# Altium schematic sheet SignalAnalyse.SchDoc
size A4
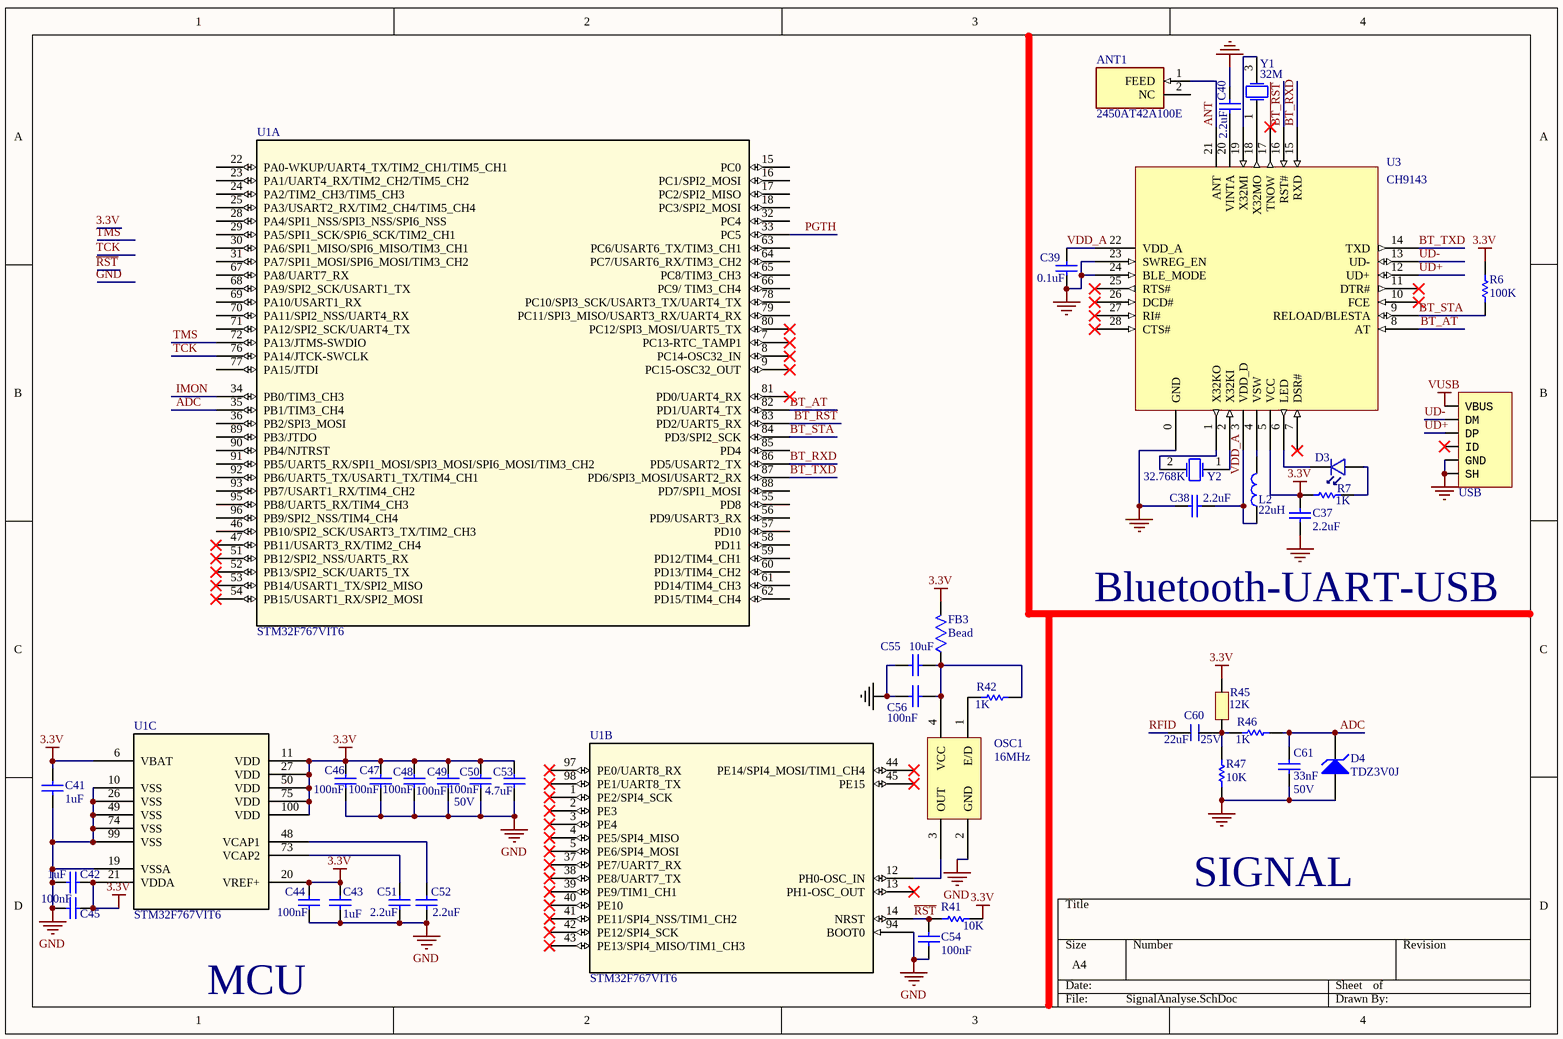
[diagram p0: SignalAnalyse.SchDoc]

## Parts
ANT1  2450AT42A100E  [ANTC5020X110N]
C37  value 2.2uF  [1608[0603]]  (hidden comment: GRM188R61A226ME15D)
C38  value 2.2uF  [1608[0603]]  (hidden comment: GRM188R61A226ME15D)
C39  value 0.1uF  [1608[0603]]  (hidden comment: GRM188R61A226ME15D)
C40  value 2.2uF  [1608[0603]]  (hidden comment: GRM188R61A226ME15D)
C41  value 1uF  [1608[0603]]  (hidden comment: GRM188R61A226ME15D)
C42  value 1uF  [1608[0603]]  (hidden comment: GRM188R61A226ME15D)
C43  value 1uF  [1608[0603]]  (hidden comment: GRM188R61A226ME15D)
C44  value 100nF  [1608[0603]]  (hidden comment: GRM188R61A226ME15D)
C45  value 100nF  [1608[0603]]  (hidden comment: GRM188R61A226ME15D)
C46  value 100nF  [1608[0603]]  (hidden comment: GRM188R61A226ME15D)
C47  value 100nF  [1608[0603]]  (hidden comment: GRM188R61A226ME15D)
C48  value 100nF  [1608[0603]]  (hidden comment: GRM188R61A226ME15D)
C49  value 100nF  [1608[0603]]  (hidden comment: GRM188R61A226ME15D)
C50  value 100nF  Voltage: 50V  [1608[0603]]  (hidden comment: GRM188R61A226ME15D)
C51  value 2.2uF  [1608[0603]]  (hidden comment: GRM188R61A226ME15D)
C52  value 2.2uF  [1608[0603]]  (hidden comment: GRM188R61A226ME15D)
C53  value 4.7uF  [1608[0603]]  (hidden comment: GRM188R61A226ME15D)
C54  value 100nF  [1608[0603]]  (hidden comment: GRM188R61A226ME15D)
C55  value 10uF  [1608[0603]]  (hidden comment: GRM188R61A226ME15D)
C56  value 100nF  [1608[0603]]  (hidden comment: GRM188R61A226ME15D)
C60  value 22uF  Voltage: 25V  [C0805]  (hidden comment: Cap Ceramic)
C61  value 33nF  Voltage: 50V  [1608[0603]]  (hidden comment: Cap Semi)
D3  LED-Green  [D0805]  (value not drawn)
D4  TDZ3V0J  [SOD-323]
FB3  Bead  [BEADC2012X110N]
L2  22uH  [L0805]
OSC1  16MHz  [OSC_3.2X2.5]
R6  value 100K  [J1-0603]  (hidden comment: Res 2.2KΩ ±1%)
R7  value 1K  [J1-0603]  (hidden comment: Res 2.2KΩ ±1%)
R41  value 10K  [J1-0603]  (hidden comment: Res 2.2KΩ ±1%)
R42  value 1K  [J1-0603]  (hidden comment: Res 2.2KΩ ±1%)
R45  value 12K  [R0805]  (hidden comment: R)
R46  value 1K  [J1-0603]  (hidden comment: Res 2.2KΩ ±1%)
R47  value 10K  [J1-0603]  (hidden comment: Res 2.2KΩ ±1%)
U1  STM32F767VIT6  [STM32F767VIT6]  (parts A,B,C of 3)
U3  CH9143  [QFN28_4X4]
USB  MicroUSB  [USB_Micro-AB]  (value not drawn)
Y1  32M  [SMD2016-4N]
Y2  32.768K  [Q13FC1350000400]

## Nets
3.3V: C37.2 C41.1 C42.1 C43.2 C44.2 C45.1 C46.2 C47.2 C48.2 C49.2 C50.2 C53.2 FB3.2 R6.1 R7.1 R41.2 R45.2 U1.6(VBAT) U1.11(VDD) U1.20(VREF+) U1.21(VDDA) U1.27(VDD) U1.50(VDD) U1.75(VDD) U1.100(VDD) U3.5(VCC)
GND: C37.1 C38.1 C39.2 C40.1 C41.2 C42.2 C43.1 C44.1 C45.2 C46.1 C47.1 C48.1 C49.1 C50.1 C51.1 C52.1 C53.1 C54.2 C55.2 C56.2 C61.1 D4.1(A) OSC1.2(GND) R47.2 U1.10(VSS) U1.19(VSSA) U1.26(VSS) U1.49(VSS) U1.74(VSS) U1.94(BOOT0) U1.99(VSS) U3.0(GND) U3.23(SWREG_EN) U3.24(BLE_MODE) USB.0(SH) USB.5(GND)
VUSB: USB.1(VBUS)
ADC: C61.2 D4.2(K) R46.2 U1.35(PB1/TIM3_CH4)
ANT: ANT1.1(FEED) U3.21(ANT)
~{BT_RST}: U1.83(PD2/UART5_RX) U3.16(RST#)
BT_AT: U1.82(PD1/UART4_TX) U3.8(AT)
BT_RXD: U1.86(PD5/USART2_TX) U3.15(RXD)
BT_STA: R6.2 U1.84(PD3/SPI2_SCK) U3.9(RELOAD/BLESTA)
BT_TXD: U1.87(PD6/SPI3_MOSI/USART2_RX) U3.14(TXD)
IMON: U1.34(PB0/TIM3_CH3)
PGTH: U1.33(PC5)
~{RST}: C54.1 R41.1 U1.14(NRST)
RFID: C60.1
TCK: U1.76(PA14/JTCK-SWCLK)
TMS: U1.72(PA13/JTMS-SWDIO)
UD+: U3.12(UD+) USB.3(DP)
UD-: U3.13(UD-) USB.2(DM)
VDD_A: C38.2 C39.1 L2.1 U3.3(VDD_D) U3.22(VDD_A)
NetC40_2: C40.2 U3.20(VINTA)
NetC51_2: C51.2 U1.73(VCAP2)
NetC52_2: C52.2 U1.48(VCAP1)
NetC55_1: C55.1 C56.1 FB3.1 OSC1.4(VCC) R42.2
NetC60_2: C60.2 R45.1 R46.1 R47.1
NetD3_1: D3.1 R7.2
NetD3_2: D3.2 U3.6(LED)
NetL2_2: L2.2 U3.4(VSW)
NetOSC1_1: OSC1.1(E/D) R42.1
NetOSC1_3: OSC1.3(OUT) U1.12(PH0-OSC_IN)
NetU3_1: U3.1(X32KO) Y2.2(CRYSTAL_2)
NetU3_2: U3.2(X32KI) Y2.1(CRYSTAL_1)
NetU3_18: U3.18(X32MO) Y1.1(OSC1)
NetU3_19: U3.19(X32MI) Y1.3(OSC2)

Not connected (* = marked no-connect by the designer): ANT1 2(NC); U1 1(PE2/SPI4_SCK)* 2(PE3)* 3(PE4)* 4(PE5/SPI4_MISO)* 5(PE6/SPI4_MOSI)* 7(PC13-RTC_TAMP1)* 8(PC14-OSC32_IN)* 9(PC15-OSC32_OUT)* 13(PH1-OSC_OUT)* 15(PC0) 16(PC1/SPI2_MOSI) 17(PC2/SPI2_MISO) 18(PC3/SPI2_MOSI) 22(PA0-WKUP/UART4_TX/TIM2_CH1/TIM5_CH1) 23(PA1/UART4_RX/TIM2_CH2/TIM5_CH2) 24(PA2/TIM2_CH3/TIM5_CH3) 25(PA3/USART2_RX/TIM2_CH4/TIM5_CH4) 28(PA4/SPI1_NSS/SPI3_NSS/SPI6_NSS) 29(PA5/SPI1_SCK/SPI6_SCK/TIM2_CH1) 30(PA6/SPI1_MISO/SPI6_MISO/TIM3_CH1) 31(PA7/SPI1_MOSI/SPI6_MOSI/TIM3_CH2) 32(PC4) 36(PB2/SPI3_MOSI) 37(PE7/UART7_RX)* 38(PE8/UART7_TX)* 39(PE9/TIM1_CH1)* 40(PE10)* 41(PE11/SPI4_NSS/TIM1_CH2)* 42(PE12/SPI4_SCK)* 43(PE13/SPI4_MISO/TIM1_CH3)* 44(PE14/SPI4_MOSI/TIM1_CH4)* 45(PE15)* 46(PB10/SPI2_SCK/USART3_TX/TIM2_CH3) 47(PB11/USART3_RX/TIM2_CH4)* 51(PB12/SPI2_NSS/UART5_RX)* 52(PB13/SPI2_SCK/UART5_TX)* 53(PB14/USART1_TX/SPI2_MISO)* 54(PB15/USART1_RX/SPI2_MOSI)* 55(PD8) 56(PD9/USART3_RX) 57(PD10) 58(PD11) 59(PD12/TIM4_CH1) 60(PD13/TIM4_CH2) 61(PD14/TIM4_CH3) 62(PD15/TIM4_CH4) 63(PC6/USART6_TX/TIM3_CH1) 64(PC7/USART6_RX/TIM3_CH2) 65(PC8/TIM3_CH3) 66(PC9/_TIM3_CH4) 67(PA8/UART7_RX) 68(PA9/SPI2_SCK/USART1_TX) 69(PA10/USART1_RX) 70(PA11/SPI2_NSS/UART4_RX) 71(PA12/SPI2_SCK/UART4_TX) 77(PA15/JTDI) 78(PC10/SPI3_SCK/USART3_TX/UART4_TX) 79(PC11/SPI3_MISO/USART3_RX/UART4_RX) 80(PC12/SPI3_MOSI/UART5_TX)* 81(PD0/UART4_RX)* 85(PD4) 88(PD7/SPI1_MOSI) 89(PB3/JTDO) 90(PB4/NJTRST) 91(PB5/UART5_RX/SPI1_MOSI/SPI3_MOSI/SPI6_MOSI/TIM3_CH2) 92(PB6/UART5_TX/USART1_TX/TIM4_CH1) 93(PB7/USART1_RX/TIM4_CH2) 95(PB8/UART5_RX/TIM4_CH3) 96(PB9/SPI2_NSS/TIM4_CH4) 97(PE0/UART8_RX)* 98(PE1/UART8_TX)*; U3 7(DSR#)* 10(FCE)* 11(DTR#)* 17(TNOW)* 25(RTS#)* 26(DCD#)* 27(RI#)* 28(CTS#)*; USB 4(ID)*

## Notes on the sheet
- Bluetooth-UART-USB
- SIGNAL
- MCU
- Labels drawn without touching a wire or pin: 3.3V, GND, TCK, TMS, ~{RST}

## Library data of the parts
ANT1 = 2450AT42A100E: Antenna; Manufacturer_Name: JOHANSON TECHNOLOGY; Datasheet Link: https://mouser.componentsearchengine.com/Datasheets/2/2450AT42A100E.pdf; Height: 1.1mm; Manufacturer_Part_Number: 2450AT42A100E; Mouser Part Number: 609-2450AT42A100E; Mouser Price/Stock: https://www.mouser.co.uk/ProductDetail/Johanson-Technology/2450AT42A100E/?qs=yCnrNFeXz%252BhaJmvBFFPWJQ%3D%3D; Arrow Part Number: 2450AT42A100E; Arrow Price/Stock: https://www.arrow.com/en/products/2450at42a100e/johanson-dielectrics
C37-C40 C53 = Cap Semi: Capacitor (Semiconductor SIM Model); Voltage: 10V; Published: 8-Jun-2000; LatestRevisionDate: 29-May-2009; LatestRevisionNote: IPC-7351 Footprint Added.; PackageReference: C1206; Publisher: Altium Limited; PackageDescription: Chip Capacitor
C41-C49 C54 C56 = Cap Semi: Capacitor (Semiconductor SIM Model); Voltage: 50V; Published: 8-Jun-2000; LatestRevisionDate: 29-May-2009; LatestRevisionNote: IPC-7351 Footprint Added.; PackageReference: C1206; Publisher: Altium Limited; PackageDescription: Chip Capacitor
C50 C61 = Cap Semi: Capacitor (Semiconductor SIM Model); Published: 8-Jun-2000; LatestRevisionDate: 29-May-2009; LatestRevisionNote: IPC-7351 Footprint Added.; Publisher: Altium Limited; PackageDescription: Chip Capacitor
  C50: PackageReference: C1206
  C61: PackageReference: C0603
C51 C52 = Cap Semi: Capacitor (Semiconductor SIM Model); Voltage: 16V; Published: 8-Jun-2000; LatestRevisionDate: 29-May-2009; LatestRevisionNote: IPC-7351 Footprint Added.; PackageReference: C1206; Publisher: Altium Limited; PackageDescription: Chip Capacitor
C55 = Cap Semi: Capacitor (Semiconductor SIM Model); Part Number: GRM188R61E106KA73D; Manufacturer: Murata; Voltage: 10V; Published: 8-Jun-2000; LatestRevisionDate: 29-May-2009; LatestRevisionNote: IPC-7351 Footprint Added.; PackageReference: C1206; Publisher: Altium Limited; PackageDescription: Chip Capacitor
C60 = C-Ceramic
D3 = LED
D4 = D Zener: Zener Diode 3V; Published: 8-Jun-2000; LatestRevisionDate: 17-Jul-2002; LatestRevisionNote: Re-released for DXP Platform.; PackageReference: DIODE-0.7; Publisher: Altium Limited; PackageDescription: Diode, Thru-Hole; 2 Leads; 0.7 in Pin Spacing
FB3 = 782853200: Wurth Ferrite Bead; Manufacturer_Name: Wurth Elektronik; Datasheet Link: http://katalog.we-online.de/pbs/datasheet/782853200.pdf; Height: 1.1mm; Manufacturer_Part_Number: 782853200
L2 = FB: Part Number: MGFL2012F220; Manufacturer: microgate; Value: 22uH
OSC1 = OSC2: OSC with disable function
R6 = Res1: Resistor; Part Number: RC0603FR-07100KL; Manufacturer: YAGEO; Published: 8-Jun-2000; LatestRevisionDate: 17-Jul-2002; LatestRevisionNote: Re-released for DXP Platform.; PackageReference: AXIAL-0.3; Publisher: Altium Limited; PackageDescription: Axial Device, Thru-Hole; 2 Leads; 0.3 in Pin Spacing
R7 R42 R46 = Res1: Resistor; Part Number: RC0603FR-071KL; Manufacturer: YAGEO; Published: 8-Jun-2000; LatestRevisionDate: 17-Jul-2002; LatestRevisionNote: Re-released for DXP Platform.; PackageReference: AXIAL-0.3; Publisher: Altium Limited; PackageDescription: Axial Device, Thru-Hole; 2 Leads; 0.3 in Pin Spacing
R41 R47 = Res1: Resistor; Part Number: RC0603FR-0710KL; Manufacturer: YAGEO; Published: 8-Jun-2000; LatestRevisionDate: 17-Jul-2002; LatestRevisionNote: Re-released for DXP Platform.; PackageReference: AXIAL-0.3; Publisher: Altium Limited; PackageDescription: Axial Device, Thru-Hole; 2 Leads; 0.3 in Pin Spacing
R45 = Res SMT: Part Number: RC0805FR-0712KL; Manufacturer: YAGEO
U1 = STM32F76XVXT: Imported; Vendor: STMicroelectronics; C: Copyright (C) 2016 Accelerated Designs. All rights reserved; Manufacturer_Part_Number: stm32f76xvxt; Copyright: Copyright (C) 2016 Accelerated Designs. All rights reserved; Value: Value; Type: Type; RefDes: RefDes
U3 = CH9143: Bluetooth-LowEnergy & UART & USB Mutual Transport
USB = USB_Micro: USB; Type: B-type
Y1 = X201632MMB4SI: Quartz Crystal Oscillator; Manufacturer_Name: Yangxing Tech; Datasheet Link: https://datasheet.lcsc.com/szlcsc/1904031205_Yangxing-Tech-X201632MMB4SI_C383840.pdf; Height: 0.5mm; Manufacturer_Part_Number: X201632MMB4SI
Y2 = Q13FC1350000400: Crystal Oscillator; Manufacturer_Name: SEIKO EPSON; Datasheet Link: https://datasheet.lcsc.com/szlcsc/1901081604_Seiko-Epson-Q13FC1350000400_C32346.pdf; Height: 0.9mm; Manufacturer_Part_Number: Q13FC1350000400